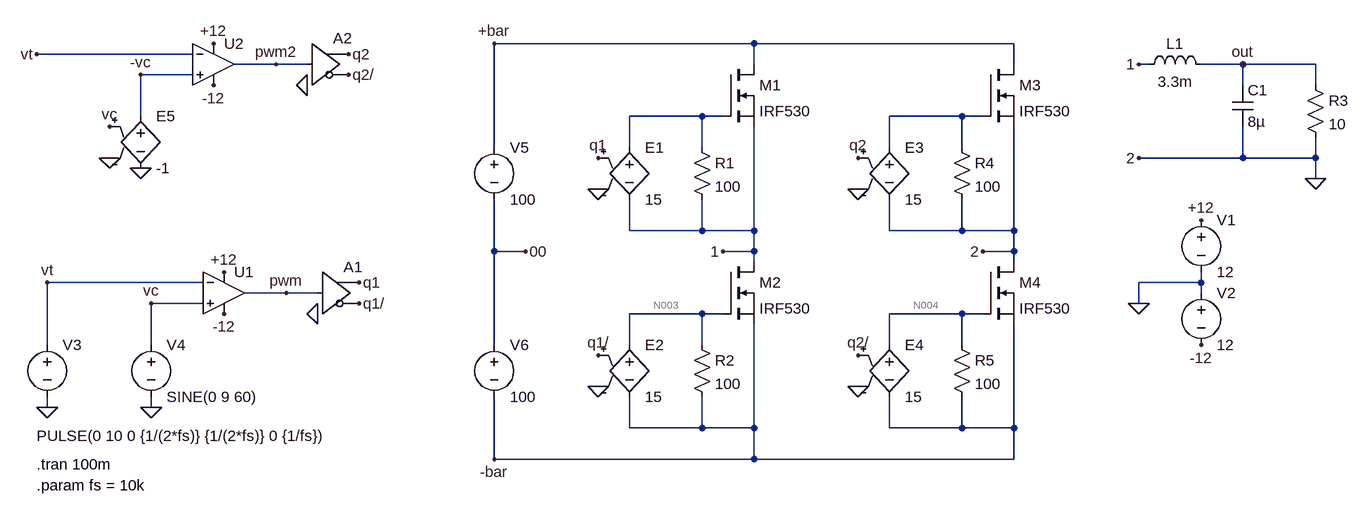
[diagram p0: schematic EXP07_2.asc]
EXP07_2.asc, the LTspice schematic file:
Version 4
SHEET 1 2024 680
WIRE 1072 -112 672 -112
WIRE 1472 -112 1072 -112
WIRE 208 -96 -32 -96
WIRE 336 -80 272 -80
WIRE 384 -80 336 -80
WIRE 1072 -80 1072 -112
WIRE 1472 -80 1472 -112
WIRE 1680 -80 1664 -80
WIRE 1824 -80 1760 -80
WIRE 1936 -80 1824 -80
WIRE 208 -64 128 -64
WIRE 1824 -48 1824 -80
WIRE 1936 -48 1936 -80
WIRE 128 0 128 -64
WIRE 992 0 880 0
WIRE 1024 0 992 0
WIRE 1392 0 1280 0
WIRE 1424 0 1392 0
WIRE 672 48 672 -112
WIRE 880 48 880 0
WIRE 992 48 992 0
WIRE 1280 48 1280 0
WIRE 1392 48 1392 0
WIRE 1824 64 1824 16
WIRE 1824 64 1664 64
WIRE 1936 64 1936 32
WIRE 1936 64 1824 64
WIRE 1936 96 1936 64
WIRE 880 176 880 128
WIRE 992 176 992 128
WIRE 992 176 880 176
WIRE 1072 176 1072 16
WIRE 1072 176 992 176
WIRE 1280 176 1280 128
WIRE 1392 176 1392 128
WIRE 1392 176 1280 176
WIRE 1472 176 1472 16
WIRE 1472 176 1392 176
WIRE 672 208 672 128
WIRE 720 208 672 208
WIRE 1072 208 1072 176
WIRE 1072 208 1024 208
WIRE 1472 208 1472 176
WIRE 1472 208 1424 208
WIRE 1072 224 1072 208
WIRE 1472 224 1472 208
WIRE 224 256 -16 256
WIRE 1760 256 1760 240
WIRE 1760 256 1664 256
WIRE 352 272 288 272
WIRE 400 272 352 272
WIRE 1760 272 1760 256
WIRE 224 288 144 288
WIRE 1664 288 1664 256
WIRE 992 304 880 304
WIRE 1024 304 992 304
WIRE 1392 304 1280 304
WIRE 1424 304 1392 304
WIRE -16 352 -16 256
WIRE 144 352 144 288
WIRE 672 352 672 208
WIRE 880 352 880 304
WIRE 992 352 992 304
WIRE 1280 352 1280 304
WIRE 1392 352 1392 304
WIRE -16 448 -16 432
WIRE 144 448 144 432
WIRE 880 480 880 432
WIRE 992 480 992 432
WIRE 992 480 880 480
WIRE 1072 480 1072 320
WIRE 1072 480 992 480
WIRE 1280 480 1280 432
WIRE 1392 480 1392 432
WIRE 1392 480 1280 480
WIRE 1472 480 1472 320
WIRE 1472 480 1392 480
WIRE 672 528 672 432
WIRE 1072 528 1072 480
WIRE 1072 528 672 528
WIRE 1472 528 1472 480
WIRE 1472 528 1072 528
FLAG 1664 288 0
FLAG -16 448 0
FLAG 144 448 0
FLAG 400 304 0
FLAG 1760 160 +12
FLAG 256 240 +12
FLAG 1760 352 -12
FLAG 256 304 -12
FLAG 464 256 q1
FLAG 464 288 q1/
FLAG -16 256 vt
FLAG 144 288 vc
FLAG 832 112 0
FLAG 832 416 0
FLAG 832 64 q1
FLAG 832 368 q1/
FLAG 1664 -80 1
FLAG 1024 208 1
FLAG 672 -112 +bar
FLAG 672 528 -bar
FLAG 1824 -80 out
FLAG 352 272 pwm
FLAG 1232 112 0
FLAG 1232 416 0
FLAG 1232 64 q2
FLAG 1232 368 q2/
FLAG 1936 96 0
FLAG 720 208 00
FLAG 1424 208 2
FLAG 1664 64 2
FLAG 384 -48 0
FLAG 240 -112 +12
FLAG 240 -48 -12
FLAG 448 -96 q2
FLAG 448 -64 q2/
FLAG -32 -96 vt
FLAG 128 -64 -vc
FLAG 336 -80 pwm2
FLAG 128 80 0
FLAG 80 64 0
FLAG 80 16 vc
SYMBOL voltage 1760 144 R0
WINDOW 123 0 0 Left 0
WINDOW 39 0 0 Left 0
SYMATTR InstName V1
SYMATTR Value 12
SYMBOL voltage 1760 256 R0
WINDOW 123 0 0 Left 0
WINDOW 39 0 0 Left 0
SYMATTR InstName V2
SYMATTR Value 12
SYMBOL voltage -16 336 R0
WINDOW 3 -16 156 Left 2
WINDOW 123 0 0 Left 0
WINDOW 39 0 0 Left 0
SYMATTR InstName V3
SYMATTR Value PULSE(0 10 0 {1/(2*fs)} {1/(2*fs)} 0 {1/fs})
SYMBOL voltage 144 336 R0
WINDOW 123 0 0 Left 0
WINDOW 39 0 0 Left 0
SYMATTR InstName V4
SYMATTR Value SINE(0 9 60)
SYMBOL voltage 672 32 R0
WINDOW 123 0 0 Left 0
WINDOW 39 0 0 Left 0
SYMATTR InstName V5
SYMATTR Value 100
SYMBOL OpAmps\\UniversalOpAmp2 256 272 R0
SYMATTR InstName U1
SYMBOL Digital\\buf 400 208 R0
SYMATTR InstName A1
SYMBOL e 880 32 R0
SYMATTR InstName E1
SYMATTR Value 15
SYMBOL nmos 1024 -80 R0
SYMATTR InstName M1
SYMATTR Value IRF530
SYMBOL res 976 32 R0
SYMATTR InstName R1
SYMATTR Value 100
SYMBOL voltage 672 336 R0
WINDOW 123 0 0 Left 0
WINDOW 39 0 0 Left 0
SYMATTR InstName V6
SYMATTR Value 100
SYMBOL e 880 336 R0
SYMATTR InstName E2
SYMATTR Value 15
SYMBOL nmos 1024 224 R0
SYMATTR InstName M2
SYMATTR Value IRF530
SYMBOL res 976 336 R0
SYMATTR InstName R2
SYMATTR Value 100
SYMBOL ind 1664 -64 R270
WINDOW 0 32 56 VTop 2
WINDOW 3 5 56 VBottom 2
SYMATTR InstName L1
SYMATTR Value 3.3m
SYMBOL cap 1808 -48 R0
SYMATTR InstName C1
SYMATTR Value 8µ
SYMATTR SpiceLine Rser=0.01
SYMBOL res 1920 -64 R0
SYMATTR InstName R3
SYMATTR Value 10
SYMBOL e 1280 32 R0
SYMATTR InstName E3
SYMATTR Value 15
SYMBOL nmos 1424 -80 R0
SYMATTR InstName M3
SYMATTR Value IRF530
SYMBOL res 1376 32 R0
SYMATTR InstName R4
SYMATTR Value 100
SYMBOL e 1280 336 R0
SYMATTR InstName E4
SYMATTR Value 15
SYMBOL nmos 1424 224 R0
SYMATTR InstName M4
SYMATTR Value IRF530
SYMBOL res 1376 336 R0
SYMATTR InstName R5
SYMATTR Value 100
SYMBOL OpAmps\\UniversalOpAmp2 240 -80 R0
SYMATTR InstName U2
SYMBOL Digital\\buf 384 -144 R0
SYMATTR InstName A2
SYMBOL e 128 -16 R0
SYMATTR InstName E5
SYMATTR Value -1
TEXT -32 536 Left 2 !.tran 100m
TEXT -32 568 Left 2 !.param fs = 10k

The netlist it stands for:
* EXP07_2.asc
V1 +12 0 12
V2 0 -12 12
V3 vt 0 PULSE(0 10 0 {1/(2*fs)} {1/(2*fs)} 0 {1/fs})
V4 vc 0 SINE(0 9 60)
V5 +bar 00 100
XU1 vc vt +12 -12 pwm level2 Avol=1Meg GBW=10Meg Slew=10Meg Ilimit=25m Rail=0 Vos=0 En=0 Enk=0 In=0 Ink=0 Rin=500Meg  ; pins In+ In- V+ V- OUT
A1 pwm 0 0 0 0 q1/ q1 0 BUF
E1 N001 1 q1 0 15
M1 +bar N001 1 1 IRF530
R1 N001 1 100
V6 00 -bar 100
E2 N003 -bar q1/ 0 15
M2 1 N003 -bar -bar IRF530
R2 N003 -bar 100
L1 1 out 3.3m
C1 out 0 8µ Rser=0.01
R3 out 0 10
E3 N002 0 q2 0 15
M3 +bar N002 0 0 IRF530
R4 N002 0 100
E4 N004 -bar q2/ 0 15
M4 0 N004 -bar -bar IRF530
R5 N004 -bar 100
XU2 -vc vt +12 -12 pwm2 level2 Avol=1Meg GBW=10Meg Slew=10Meg Ilimit=25m Rail=0 Vos=0 En=0 Enk=0 In=0 Ink=0 Rin=500Meg  ; pins In+ In- V+ V- OUT
A2 pwm2 0 0 0 0 q2/ q2 0 BUF
E5 -vc 0 vc 0 -1
.model NMOS NMOS
.model PMOS PMOS
.lib standard.mos
.tran 100m
.param fs = 10k
.lib UniversalOpAmp2.lib
.backanno
.end

* Results of the author's LTspice run, read from the files saved beside the schematic
* Operating Point, zero values left out:
*   V(+12) = 12 V
*   V(-12) = -12 V
*   V(+bar) = 200 V
*   V(00) = 100 V
*   V(q1/) = 1 V
*   V(n003) = 15 V
*   V(n004) = 15 V
*   V(q2/) = 1 V
*   Id(M4) = 452.6 pA
*   Is(M4) = -452.6 pA
*   Id(M3) = 251.5 pA
*   Is(M3) = -251.5 pA
*   Id(M2) = 452.1 pA
*   Is(M2) = -452.1 pA
*   Id(M1) = 251.5 pA
*   Is(M1) = -251.5 pA
*   I(R5) = 150 mA
*   I(R2) = 150 mA
*   I(E4) = -150 mA
*   I(E2) = -150 mA
*   I(V6) = -904.9 pA
*   I(V5) = -904.9 pA
*   I(V2) = -2.398 mA
*   I(V1) = -2.398 mA
*   Ix(u1:3) = 1.199 mA
*   Ix(u1:4) = -1.199 mA
*   Ix(u2:3) = 1.199 mA
*   Ix(u2:4) = -1.199 mA